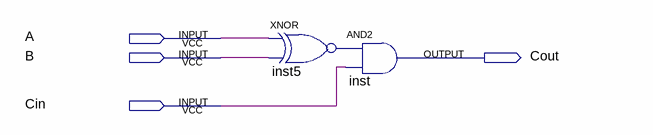
[diagram p0: schematic sheet]
// Quartus schematic equals1bit.bdf as structural Verilog: 2 symbols, 4 pins
module equals1bit (
  input  A,
  input  B,
  input  Cin,
  output Cout
);

  wire inst5_out;

  xnor inst5 (inst5_out, A, B);
  and inst (Cout, inst5_out, Cin);
endmodule
